# Altium project solidstate-power.PrjPCB
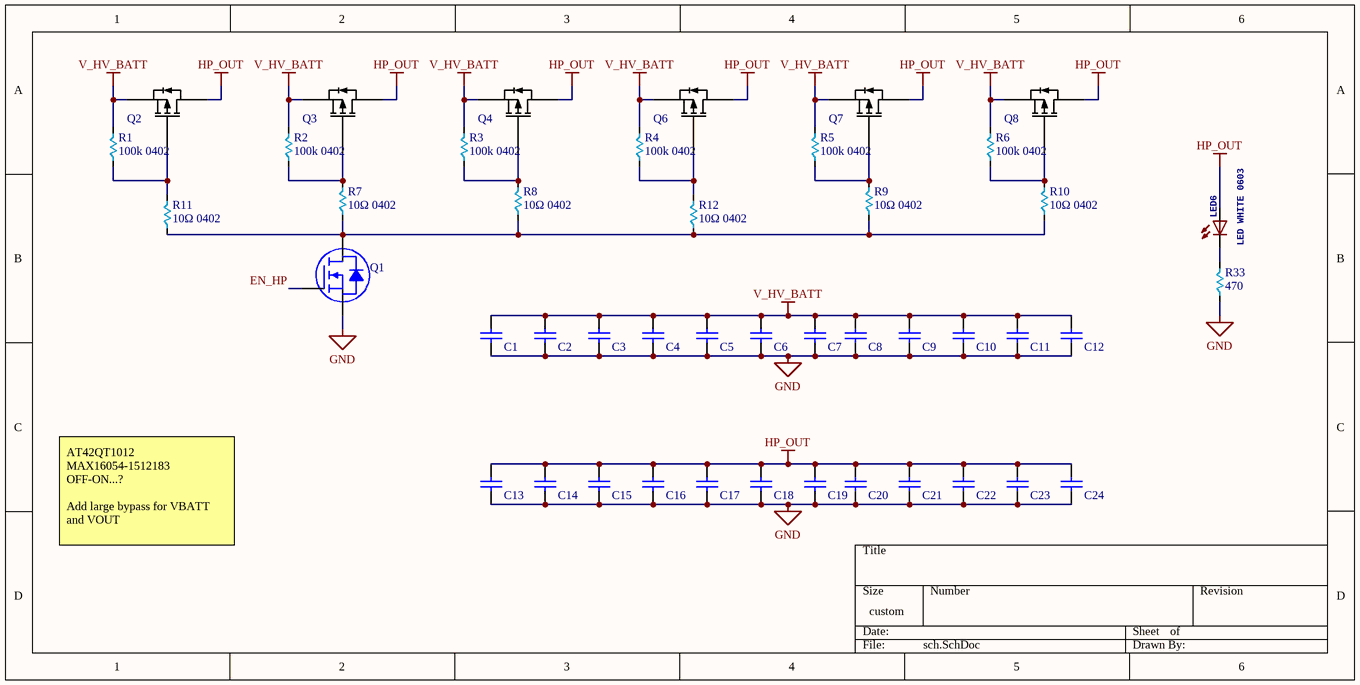
[diagram p0: sch.SchDoc]
1 sheet, 45 parts. Net scope: global (net labels, ports and power ports of the same name join across sheets).
Board file: pcb.PcbDoc

## Sheet sch.SchDoc
size 254 x 127 mm

### Parts
C1  22uF  [C1210]  (value not drawn)
C2  22uF  [C1210]  (value not drawn)
C3  22uF  [C1210]  (value not drawn)
C4  22uF  [C1210]  (value not drawn)
C5  22uF  [C1210]  (value not drawn)
C6  22uF  [C1210]  (value not drawn)
C7  22uF  [C1210]  (value not drawn)
C8  22uF  [C1210]  (value not drawn)
C9  22uF  [C1210]  (value not drawn)
C10  22uF  [C1210]  (value not drawn)
C11  22uF  [C1210]  (value not drawn)
C12  22uF  [C1210]  (value not drawn)
C13  22uF  [C1210]  (value not drawn)
C14  22uF  [C1210]  (value not drawn)
C15  22uF  [C1210]  (value not drawn)
C16  22uF  [C1210]  (value not drawn)
C17  22uF  [C1210]  (value not drawn)
C18  22uF  [C1210]  (value not drawn)
C19  22uF  [C1210]  (value not drawn)
C20  22uF  [C1210]  (value not drawn)
C21  22uF  [C1210]  (value not drawn)
C22  22uF  [C1210]  (value not drawn)
C23  22uF  [C1210]  (value not drawn)
C24  22uF  [C1210]  (value not drawn)
LED6  LED WHITE 0603  [LED_0603]
Q1  HP-MOS  [VSON-8-NFET]  (value not drawn)
Q2  High power mosfet  [DPAK]  (value not drawn)
Q3  High power mosfet  [DPAK]  (value not drawn)
Q4  High power mosfet  [DPAK]  (value not drawn)
Q6  High power mosfet  [DPAK]  (value not drawn)
Q7  High power mosfet  [DPAK]  (value not drawn)
Q8  High power mosfet  [DPAK]  (value not drawn)
R1  100k 0402  [R0402]
R2  100k 0402  [R0402]
R3  100k 0402  [R0402]
R4  100k 0402  [R0402]
R5  100k 0402  [R0402]
R6  100k 0402  [R0402]
R7  10Ω 0402  [R0402]
R8  10Ω 0402  [R0402]
R9  10Ω 0402  [R0402]
R10  10Ω 0402  [R0402]
R11  10Ω 0402  [R0402]
R12  10Ω 0402  [R0402]
R33  470  [R0402]

### Nets
GND: C1.1 C2.1 C3.1 C4.1 C5.1 C6.1 C7.1 C8.1 C9.1 C10.1 C11.1 C12.1 C13.1 C14.1 C15.1 C16.1 C17.1 C18.1 C19.1 C20.1 C21.1 C22.1 C23.1 C24.1 Q1.S R33.2
HP_OUT: C13.2 C14.2 C15.2 C16.2 C17.2 C18.2 C19.2 C20.2 C21.2 C22.2 C23.2 C24.2 LED6.A Q2.4(D) Q3.4(D) Q4.4(D) Q6.4(D) Q7.4(D) Q8.4(D)
V_HV_BATT: C1.2 C2.2 C3.2 C4.2 C5.2 C6.2 C7.2 C8.2 C9.2 C10.2 C11.2 C12.2 Q2.3(S) Q3.3(S) Q4.3(S) Q6.3(S) Q7.3(S) Q8.3(S) R1.1 R2.1 R3.1 R4.1 R5.1 R6.1
EN_HP: Q1.G
NetLED6_C: LED6.C R33.1
NetQ1_D: Q1.D R7.2 R8.2 R9.2 R10.2 R11.2 R12.2
NetQ2_1: Q2.1(G) R1.2 R11.1
NetQ3_1: Q3.1(G) R2.2 R7.1
NetQ4_1: Q4.1(G) R3.2 R8.1
NetQ6_1: Q6.1(G) R4.2 R12.1
NetQ7_1: Q7.1(G) R5.2 R9.1
NetQ8_1: Q8.1(G) R6.2 R10.1

### Notes on the sheet
- AT42QT1012
  MAX16054-1512183
  OFF-ON...?
  Add large bypass for VBATT and VOUT

### Library data of the parts
C1-C24 = C-22uF-1206: 22uF 1206; ComponentLink1URL: http://www1.futureelectronics.com/doc/SAMSUNG/CL05F104ZO5NNNC.pdf; ComponentLink1Description: http://www1.futureelectronics.com/doc/SAMSUNG/CL05F104ZO5NNNC.pdf; ComponentLink2URL: https://www.verical.com/server-webapp/html/getDatasheet?partID=358403; ComponentLink2Description: https://www.verical.com/server-webapp/html/getDatasheet?partID=358403; ComponentLink3URL: https://produktinfo.conrad.com/datenblaetter/450000-474999/458504-da-01-en-VS_KONDENSATOR_0402.pdf; ComponentLink3Description: https://produktinfo.conrad.com/datenblaetter/450000-474999/458504-da-01-en-VS_KONDENSATOR_0402.pdf; ComponentLink4URL: http://www.samsungsem.com/kr/support/product-search/mlcc/CL10A475MQ8NNNC.jsp?src-supplier=Digi-Key; ComponentLink4Description: http://www.samsungsem.com/kr/support/product-search/mlcc/CL10A475MQ8NNNC.jsp?src-supplier=Digi-Key; ComponentLink5URL: https://www.verical.com/server-webapp/html/getDatasheet?partID=358407&src-supplier=Verical; ComponentLink5Description: https://www.verical.com/server-webapp/html/getDatasheet?partID=358407&src-supplier=Verical; ComponentLink6URL: http://www1.futureelectronics.com/doc/SAMSUNG%20PASSIVE/CL05B104KQ5NNNC.pdf?src-supplier=Future+Electronics; ComponentLink6Description: http://www1.futureelectronics.com/doc/SAMSUNG%20PASSIVE/CL05B104KQ5NNNC.pdf?src-supplier=Future+Electronics
LED6 = LED_ESML0603: LED   Source: http://www.osram.convergy.de   Source: www.luxeon.com   Source: www.kingbright.com; Manufacturer: Dialight; Manufacturer Part Number: 5988070107F; Description 1: DIALIGHT - 5988070107F - LED, 0603, GREEN, 20MCD, 566NM; Color: Green; Lens Color: Colorless,Clear; Forward Voltage: 2V; Forward Current: 20mA; Wavelength: 570nm; Luminous Intensity: 20mcd; Viewing Angle: 140°; Lens Style: Flat,Rectangular,Diffused,Colorless,Clear; Dominant Wavelength: 568nm; Number of Elements: 1; Power Dissipation: 60mW; Reverse Voltage: 5V; Lens Transparency: Clear; Lens Size: 0.8mm; SPICEMODEL: NONE; SPICEPREFIX: D; SPICETYPE: diode; Supplier 1: Digi-Key; Supplier Part Number 1: 350-2035-6-ND; Stock: 221494; Pricing: 1=0.48, 10=0.346, 25=0.2652, 100=0.1731, 250=0.12692, 500=0.1077, 1000=0.08846 (USD); Mount: Surface Mount; Case/Package: 0603; Number of Pins: 2; Case Code (Metric): 1608; Case Code (Imperial): 0603; Min Operating Temperature: -30°C; Max Operating Temperature: 100°C; Package Quantity: 4000; Packaging: Tape and Reel; Illumination Color: Green; Test Current: 20mA; Number of LEDs: 1; Length: 1.6mm; Height: 0.7mm; Depth: 0.8mm; Width: 0.8mm; Radiation Hardening: No; Lead Free: Lead Free; REACH SVHC: No SVHC; ComponentLink1URL: http://www.mouser.com/ds/2/109/SMT_selector_guide-267443.pdf?src-supplier=Mouser; ComponentLink1Description: http://www.mouser.com/ds/2/109/SMT_selector_guide-267443.pdf?src-supplier=Mouser; ComponentLink2URL: http://uk.rs-online.com/webdocs/0ae2/0900766b80ae2975.pdf?src-supplier=RSComponents; ComponentLink2Description: http://uk.rs-online.com/webdocs/0ae2/0900766b80ae2975.pdf?src-supplier=RSComponents; ComponentLink3URL: http://www.farnell.com/datasheets/1720200.pdf?src-supplier=Element14; ComponentLink3Description: http://www.farnell.com/datasheets/1720200.pdf?src-supplier=Element14; ComponentLink4URL: https://media.digikey.com/pdf/Data%20Sheets/Dialight%20PDFs/598_Series_0603_Pkg.pdf?src-supplier=Digi-Key; ComponentLink4Description: https://media.digikey.com/pdf/Data%20Sheets/Dialight%20PDFs/598_Series_0603_Pkg.pdf?src-supplier=Digi-Key; ComponentLink5URL: http://www.farnell.com/datasheets/1484480.pdf?src-supplier=Element14; ComponentLink5Description: http://www.farnell.com/datasheets/1484480.pdf?src-supplier=Element14; ComponentLink6URL: https://www.alliedelec.com/m/d/745256ca487aea7b70ea31e2d673d5bb.pdf?src-supplier=Allied+Electronics; ComponentLink6Description: https://www.alliedelec.com/m/d/745256ca487aea7b70ea31e2d673d5bb.pdf?src-supplier=Allied+Electronics; ComponentLink7URL: http://www.onlinecomponents.com/productFiles/mf-DIA/mdei5980603.pdf?src-supplier=Onlinecomponents.com; ComponentLink7Description: http://www.onlinecomponents.com/productFiles/mf-DIA/mdei5980603.pdf?src-supplier=Onlinecomponents.com; ComponentLink8URL: https://www.verical.com/server-webapp/html/getDatasheet?partID=146438&src-supplier=Verical; ComponentLink8Description: https://www.verical.com/server-webapp/html/getDatasheet?partID=146438&src-supplier=Verical; ComponentLink9URL: http://www.dialight.com/Assets/Brochures_And_Catalogs/Indication/SMT_selector_guide.pdf?src-supplier=Future+Electronics; ComponentLink9Description: http://www.dialight.com/Assets/Brochures_And_Catalogs/Indication/SMT_selector_guide.pdf?src-supplier=Future+Electronics
Q1 = N-MOS: Originally design used: CSD17577Q3A / Superior TI choice: CSD17579Q3A / Cheapest Option: AON7400B; Manufacturer: Alpha & Omega Semiconductor; Description 1: MOSFET N-CH 30V 30A 8DFN; Rds On Max: 7.5mR; Input Capacitance: 1.44nF; Drain to Source Voltage (Vdss): 30V; Continuous Drain Current (ID): 40A; Max Power Dissipation: 4.1W; Supplier 1: Digi-Key; Supplier Part Number 1: 785-1677-6-ND; Manufacturer Part Number: AON7400B; Stock: 5413; Pricing: 1=0.53, 10=0.415, 100=0.2848, 500=0.19528, 1000=0.14647, 2500=0.13426 (USD); Mount: Surface Mount; Min Operating Temperature: -55°C; Max Operating Temperature: 150°C; Package Quantity: 5000; Packaging: Tape and Reel; ComponentLink1URL: http://aosmd.com/res/data_sheets/AON7400B.pdf?src-supplier=Digi-Key; ComponentLink1Description: http://aosmd.com/res/data_sheets/AON7400B.pdf?src-supplier=Digi-Key
Q2-Q4 Q6-Q8 = P-MOS-DPAK
R1-R6 = R-100k-0402
R7-R12 = R-10-0402
R33 = r0402: Manufacturer: Yageo; Manufacturer Part Number: RC0402JR-07470RL; Description 1: RES SMD 470 OHM 5% 1/16W 0402; Tolerance: 5%; Voltage Rating: 50V; Resistance: 470R; Power Rating: 62.5mW; Temperature Coefficient: 100ppm/°C; Max Power Dissipation: 63mW; Supplier 1: Digi-Key; Supplier Part Number 1: 311-470JRDKR-ND; Stock: 2903670; Pricing: 1=0.1, 10=0.013, 100=0.0055, 1000=0.00245, 2500=0.00212, 5000=0.00176 (USD); Case/Package: 0402; Case Code (Metric): 1005; Case Code (Imperial): 0402; Min Operating Temperature: -55°C; Max Operating Temperature: 155°C; Packaging: Tape and Reel; Package Quantity: 1; Termination: SMD/SMT; Composition: Thick Film; Features: Moisture Resistant; Number of Terminations: 2; Military Standard: Not; Working Voltage: 50V; Length: 1mm; Height: 0.016inch; Width: 0.02inch; Depth: 0.5mm; REACH SVHC: Unknown; Lead Free: Lead Free; ComponentLink1URL: http://www.yageo.com/documents/recent/PYu-RC_Group_51_RoHS_L_10.pdf?src-supplier=Digi-Key; ComponentLink1Description: http://www.yageo.com/documents/recent/PYu-RC_Group_51_RoHS_L_10.pdf?src-supplier=Digi-Key; ComponentLink2URL: http://www.farnell.com/datasheets/1018594.pdf?src-supplier=Element14; ComponentLink2Description: http://www.farnell.com/datasheets/1018594.pdf?src-supplier=Element14; ComponentLink3URL: http://www.mouser.com/ds/2/447/PYu-RC0402_51_RoHS_L_6_r-8721.pdf?src-supplier=Mouser; ComponentLink3Description: http://www.mouser.com/ds/2/447/PYu-RC0402_51_RoHS_L_6_r-8721.pdf?src-supplier=Mouser